# Altium schematic sheet ClockSystem.SchDoc
size 594 x 420 mm
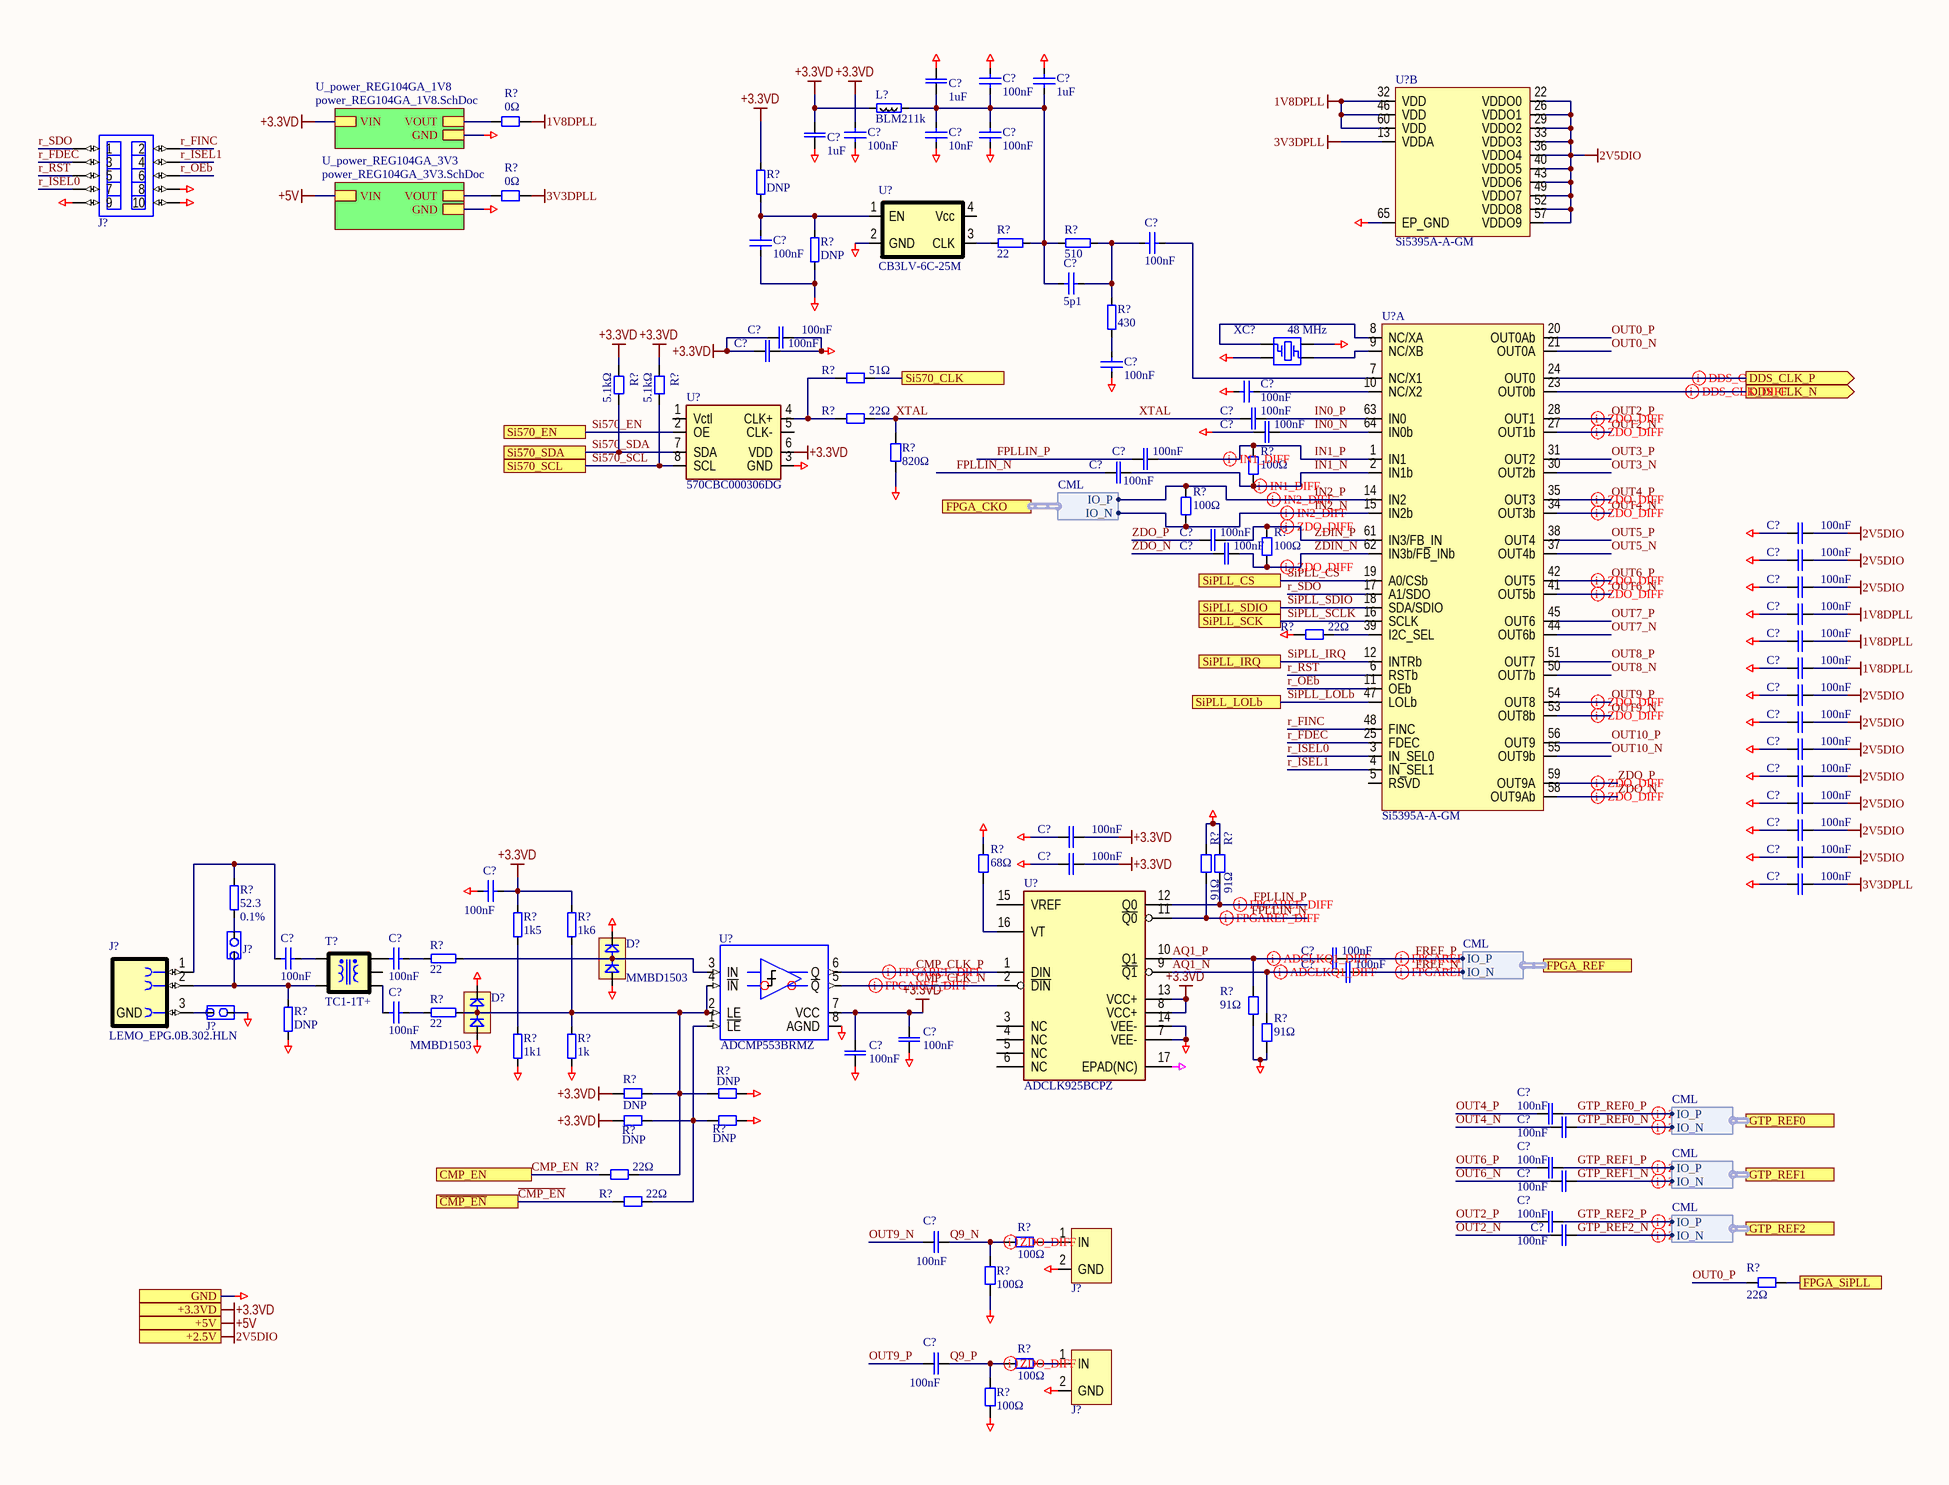
[diagram p0: ClockSystem.SchDoc]

## Parts
(Parts that share a designator on the sheet are numbered #1, #2 ... from top to bottom, then left to right.)
C?#1  100nF  [SMD0805CAP]
C?#2  1uF  [SMD0805CAP]
C?#3  1uF  [0508]
C?#4  1uF  [0508]
C?#5  100nF  [CAPC1608X87N]
C?#6  10nF  [CAPC1608X87N]
C?#7  100nF  [CAPC1608X87N]
C?#8  100nF  [CAPC1608X87N]
C?#9  100nF  [CAPC1608X87N]
C?#10  5p1  [CAPC1608X87N]
C?#11  100nF  [CAPC1608N]
C?#12  100nF  [CAPC1608N]
C?#13  100nF  [CAPC1608X87N]
C?#14  100nF  [CAPC1608X87N]
C?#15  100nF  [CAPC1608N]
C?#16  100nF  [CAPC1608N]
C?#17  100nF  [CAPC1608N]
C?#18  100nF  [CAPC1608N]
C?#19  100nF  [CAPC1608N]
C?#20  100nF  [CAPC1608N]
C?#21  100nF  [CAPC1608N]
C?#22  100nF  [CAPC1608N]
C?#23  100nF  [CAPC1608N]
C?#24  100nF  [CAPC1608N]
C?#25  100nF  [CAPC1608N]
C?#26  100nF  [CAPC1608N]
C?#27  100nF  [CAPC1608N]
C?#28  100nF  [CAPC1608N]
C?#29  100nF  [CAPC1608N]
C?#30  100nF  [CAPC1608N]
C?#31  100nF  [CAPC1608N]
C?#32  100nF  [CAPC1608N]
C?#33  100nF  [CAPC1608N]
C?#34  100nF  [CAPC1608N]
C?#35  100nF  [CAPC1608N]
C?#36  100nF  [CAPC1608N]
C?#37  100nF  [SMD0805CAP]
C?#38  100nF  [SMD0805CAP]
C?#39  100nF  [SMD0805CAP]
C?#40  100nF  [CAPC1608N]
C?#41  100nF  [CAPC1608N]
C?#42  100nF  [SMD0805CAP]
C?#43  100nF  [CAPC1608N]
C?#44  100nF  [CAPC1608N]
C?#45  100nF  [CAPC1608N]
C?#46  100nF  [CAPC1608N]
C?#47  100nF  [CAPC1608N]
C?#48  100nF  [CAPC1608N]
C?#49  100nF  [CAPC1608N]
C?#50  100nF  [CAPC1608N]
C?#51  100nF  [CAPC1608N]
C?#52  100nF  [CAPC1608N]
D?#1  MMBD1503  [SOT95P280X115-3N]
D?#2  MMBD1503  [SOT95P280X115-3N]
J?#1  DNP  [PLD-10]  (value not drawn)
J?#2  PLS-2  [PLS-2]  (value not drawn)
J?#3  LEMO_EPG.0B.302.HLN  [LEMO_EPG.0B.302.HLN]
J?#4  PLS-2  [PLS-2]  (value not drawn)
J?#5  DNP  [LEMO_EPA.00.250.NTN]  (value not drawn)
J?#6  DNP  [LEMO_EPA.00.250.NTN]  (value not drawn)
L?  BLM211k  [RESC2012X50N]
R?#1  0Ω  [RESC2012N]
R?#2  0Ω  [RESC2012N]
R?#3  DNP  [SMD0805RES]
R?#4  22  [SMD0805RES]
R?#5  510  [SMD0805RES]
R?#6  DNP  [SMD0805RES]
R?#7  430  [SMD0805RES]
R?#8  5.1kΩ  [RESC2012N]
R?#9  5.1kΩ  [RESC2012N]
R?#10  51Ω  [RESC2012N]
R?#11  22Ω  [RESC1608N]
R?#12  820Ω  [RESC1608N]
R?#13  100Ω  [RESC1608N]
R?#14  100Ω  [RESC1608N]
R?#15  100Ω  [RESC1608N]
R?#16  22Ω  [RESC1608N]
R?#17  68Ω  [RESC1608N]
R?#18  91Ω  [RESC1608N]
R?#19  91Ω  [RESC1608N]
R?#20  52.3  Tolerance: 0.1%  [SMD0805RES]
R?#21  1k5  [SMD0805RES]
R?#22  1k6  [SMD0805RES]
R?#23  22  [SMD0805RES]
R?#24  22  [SMD0805RES]
R?#25  91Ω  [RESC1608N]
R?#26  DNP  [SMD0805RES]
R?#27  91Ω  [RESC1608N]
R?#28  1k1  [SMD0805RES]
R?#29  1k  [SMD0805RES]
R?#30  DNP  [RESC1608N]
R?#31  DNP  [RESC1608N]
R?#32  DNP  [RESC1608N]
R?#33  DNP  [RESC1608N]
R?#34  22Ω  [RESC1608N]
R?#35  22Ω  [RESC1608N]
R?#36  100Ω  [RESC1608N]
R?#37  22Ω  [RESC1608N]
R?#38  100Ω  [RESC1608N]
R?#39  100Ω  [RESC1608N]
R?#40  100Ω  [RESC1608N]
T?  TC1-1T+  [XFMR_MINI-CIRCUITS_AT224]
U?#1  Si5395A-A-GM  [QFN50P900X900X100-65N-S530]  (part B of 2)
U?#2  CB3LV-6C-25M  [OSCSC508P500X700X160-4N]
U?#3  Si5395A-A-GM  [QFN50P900X900X100-65N-S530]  (part A of 2)
U?#4  570CBC000306DG  [FP-57x-MFG]
U?#5  ADCLK925BCPZ  [QFN50P300X300X100-17N-S150]
U?#6  ADCMP553BRMZ  [SOP65P490X110-8N]
XC?  value 48 MHz  [SMD3225_4PIN_XTAL]  (hidden comment: CX3225SB48000D0WPSC1)

## Sub-sheets
U_power_REG104GA_1V8 = power_REG104GA_1V8.SchDoc: GND, VOUT, VIN
U_power_REG104GA_3V3 = power_REG104GA_3V3.SchDoc: GND, VOUT, VIN

## Ports
+2.5V, +3.3VD, +5V, CMP_EN, DDS_CLK_N (out), DDS_CLK_P (out), FPGA_CKO (harness CML), FPGA_REF (harness CML), FPGA_SiPLL, GND, GTP_REF0 (harness CML), GTP_REF1 (harness CML), GTP_REF2 (harness CML), Si570_CLK, Si570_EN, Si570_SCL, Si570_SDA, SiPLL_CS, SiPLL_IRQ, SiPLL_LOLb, SiPLL_SCK, SiPLL_SDIO, ~{CMP_EN}

## Harnesses
CML: IO_N, IO_P

## Nets
1V8DPLL: C?#24.2 C?#25.2 C?#26.2 R?#1.1 U?#1.32(VDD) U?#1.46(VDD) U?#1.60(VDD)
2V5DIO: C?#19.2 C?#22.2 C?#23.2 C?#27.2 C?#28.2 C?#29.2 C?#30.2 C?#31.2 C?#32.2 C?#34.2 U?#1.22(VDDO0) U?#1.26(VDDO1) U?#1.29(VDDO2) U?#1.33(VDDO3) U?#1.36(VDDO4) U?#1.40(VDDO5) U?#1.43(VDDO6) U?#1.49(VDDO7) U?#1.52(VDDO8) U?#1.57(VDDO9) ; port +2.5V
3V3DPLL: C?#36.2 R?#2.1 U?#1.13(VDDA)
+3.3VD: C?#4.1 C?#5.2 C?#11.1 C?#12.1 C?#33.2 C?#35.2 C?#37.1 C?#43.1 C?#44.1 L?.1 R?#3.2 R?#8.1 R?#9.1 R?#21.2 R?#22.2 R?#30.1 R?#32.1 U?#4.6(VDD) U?#5.8(VCC+) U?#5.13(VCC+) U?#6.7(VCC) ; port +3.3VD, sheet U_power_REG104GA_1V8/VIN
+5V: port +5V, sheet U_power_REG104GA_3V3/VIN
GEPAD: U?#5.17(EPAD(NC))
GND: C?#1.1 C?#2.1 C?#3.2 C?#4.2 C?#5.1 C?#6.1 C?#7.1 C?#9.1 C?#11.2 C?#12.2 C?#13.1 C?#14.2 C?#16.1 C?#19.1 C?#22.1 C?#23.1 C?#24.1 C?#25.1 C?#26.1 C?#27.1 C?#28.1 C?#29.1 C?#30.1 C?#31.1 C?#32.1 C?#33.1 C?#34.1 C?#35.1 C?#36.1 C?#37.2 C?#43.2 C?#44.2 D?#1.1 D?#1.2 D?#2.1 D?#2.2 J?#1.8 J?#1.9 J?#1.10 J?#4.2 J?#5.2(GND) J?#6.2(GND) R?#6.1 R?#12.2 R?#16.1 R?#17.2 R?#18.2 R?#19.2 R?#25.1 R?#26.1 R?#27.1 R?#28.1 R?#29.1 R?#31.2 R?#33.2 R?#38.1 R?#40.1 U?#1.65(EP_GND) U?#2.2(GND) U?#4.3(GND) U?#5.7(VEE-) U?#5.14(VEE-) U?#6.8(AGND) XC?.2(SLD) XC?.4(SLD) ; port GND, sheet U_power_REG104GA_1V8/GND, sheet U_power_REG104GA_3V3/GND
AQ1_N: C?#41.1 R?#27.2 U?#5.9(~{Q1})
AQ1_P: C?#40.1 R?#25.2 U?#5.10(Q1)
~{CMP_EN}: R?#35.1 ; port ~{CMP_EN}
CMP_CLK_N: U?#5.2(~{DIN}) U?#6.5(~{Q})
CMP_CLK_P: U?#5.1(DIN) U?#6.6(Q)
CMP_EN: R?#34.1 ; port CMP_EN
DDS_CLK_N: U?#3.23(OUT0b) ; port DDS_CLK_N
DDS_CLK_P: U?#3.24(OUT0) ; port DDS_CLK_P
FPGA_SiPLL: R?#37.2 ; port FPGA_SiPLL
FPLLIN_N: C?#18.1 R?#18.1 U?#5.11(~{Q0})
FPLLIN_P: C?#17.1 R?#19.1 U?#5.12(Q0)
FREF_N: C?#41.2 ; port FPGA_REF.IO_N
FREF_P: C?#40.2 ; port FPGA_REF.IO_P
GTP_REF0_N: C?#46.2 ; port GTP_REF0.IO_N
GTP_REF0_P: C?#45.2 ; port GTP_REF0.IO_P
GTP_REF1_N: C?#48.2 ; port GTP_REF1.IO_N
GTP_REF1_P: C?#47.2 ; port GTP_REF1.IO_P
GTP_REF2_N: C?#50.2 ; port GTP_REF2.IO_N
GTP_REF2_P: C?#49.2 ; port GTP_REF2.IO_P
IN0_N: C?#16.2 U?#3.64(IN0b)
IN0_P: C?#15.2 U?#3.63(IN0)
IN1_N: C?#18.2 R?#13.1 U?#3.2(IN1b)
IN1_P: C?#17.2 R?#13.2 U?#3.1(IN1)
IN2_N: R?#14.1 U?#3.15(IN2b) ; port FPGA_CKO.IO_N
IN2_P: R?#14.2 U?#3.14(IN2) ; port FPGA_CKO.IO_P
OUT0_N: U?#3.21(OUT0A)
OUT0_P: R?#37.1 U?#3.20(OUT0Ab)
OUT2_N: C?#50.1 U?#3.27(OUT1b)
OUT2_P: C?#49.1 U?#3.28(OUT1)
OUT3_N: U?#3.30(OUT2b)
OUT3_P: U?#3.31(OUT2)
OUT4_N: C?#46.1 U?#3.34(OUT3b)
OUT4_P: C?#45.1 U?#3.35(OUT3)
OUT5_N: U?#3.37(OUT4b)
OUT5_P: U?#3.38(OUT4)
OUT6_N: C?#48.1 U?#3.41(OUT5b)
OUT6_P: C?#47.1 U?#3.42(OUT5)
OUT7_N: U?#3.44(OUT6b)
OUT7_P: U?#3.45(OUT6)
OUT8_N: U?#3.50(OUT7b)
OUT8_P: U?#3.51(OUT7)
OUT9_N: C?#51.1 U?#3.53(OUT8b)
OUT9_P: C?#52.1 U?#3.54(OUT8)
OUT10_N: U?#3.55(OUT9b)
OUT10_P: U?#3.56(OUT9)
Q9_N: C?#51.2 R?#36.1 R?#38.2
Q9_P: C?#52.2 R?#39.1 R?#40.2
r_FDEC: J?#1.3 U?#3.25(FDEC)
r_FINC: J?#1.2 U?#3.48(FINC)
r_ISEL0: J?#1.7 U?#3.3(IN_SEL0)
r_ISEL1: J?#1.4 U?#3.4(IN_SEL1)
r_OEb: J?#1.6 U?#3.11(OEb)
r_RST: J?#1.5 U?#3.6(RSTb)
r_SDO: J?#1.1 U?#3.17(A1/SDO)
Si570_CLK: R?#10.2 ; port Si570_CLK
Si570_EN: U?#4.2(OE) ; port Si570_EN
Si570_SCL: R?#9.2 U?#4.8(SCL) ; port Si570_SCL
Si570_SDA: R?#8.2 U?#4.7(SDA) ; port Si570_SDA
SiPLL_CS: U?#3.19(A0/CSb) ; port SiPLL_CS
SiPLL_IRQ: U?#3.12(INTRb) ; port SiPLL_IRQ
SiPLL_LOLb: U?#3.47(LOLb) ; port SiPLL_LOLb
SiPLL_SCLK: U?#3.16(SCLK) ; port SiPLL_SCK
SiPLL_SDIO: U?#3.18(SDA/SDIO) ; port SiPLL_SDIO
XTAL: C?#15.1 R?#11.2 R?#12.1
ZDIN_N: C?#21.2 R?#15.1 U?#3.62(IN3b/FB_INb)
ZDIN_P: C?#20.2 R?#15.2 U?#3.61(IN3/FB_IN)
ZDO_N: C?#21.1 U?#3.58(OUT9Ab)
ZDO_P: C?#20.1 U?#3.59(OUT9A)
NetC?#1_2: C?#1.2 C?#2.2 C?#3.1 C?#6.2 C?#7.2 C?#10.2 L?.2 R?#4.1 R?#5.2
NetC?#8_1: C?#8.1 U?#3.7(NC/X1)
NetC?#8_2: C?#8.2 C?#10.1 R?#5.1 R?#7.1
NetC?#9_2: C?#9.2 R?#3.1 R?#6.2 U?#2.1(EN)
NetC?#13_2: C?#13.2 R?#7.2
NetC?#14_1: C?#14.1 U?#3.10(NC/X2)
NetC?#38_1: C?#38.1 J?#3.1 R?#20.2
NetC?#38_2: C?#38.2 T?.4
NetC?#39_1: C?#39.1 T?.3
NetC?#39_2: C?#39.2 R?#23.2
NetC?#42_1: C?#42.1 T?.1
NetC?#42_2: C?#42.2 R?#24.2
NetD?#1_3: D?#1.3 R?#23.1 U?#6.3(IN)
NetD?#2_3: D?#2.3 R?#22.1 R?#24.1 R?#29.2 R?#30.2 R?#31.1 R?#34.2 U?#6.2(LE) U?#6.4(~{IN})
NetJ?#2_1: J?#2.1 J?#3.2 R?#26.2 T?.6
NetJ?#2_2: J?#2.2 R?#20.1
NetJ?#3_3: J?#3.3(GND) J?#4.1
NetJ?#5_1: J?#5.1(IN) R?#36.2
NetJ?#6_1: J?#6.1(IN) R?#39.2
NetR?#1_2: R?#1.2 ; sheet U_power_REG104GA_1V8/VOUT
NetR?#2_2: R?#2.2 ; sheet U_power_REG104GA_3V3/VOUT
NetR?#4_2: R?#4.2 U?#2.3(CLK)
NetR?#10_1: R?#10.1 R?#11.1 U?#4.4(CLK+)
NetR?#16_2: R?#16.2 U?#3.39(I2C_SEL)
NetR?#17_1: R?#17.1 U?#5.16(VT)
NetR?#21_1: R?#21.1 R?#28.2
NetR?#32_2: R?#32.2 R?#33.1 R?#35.2 U?#6.1(~{LE})
NetU?#3_8: U?#3.8(NC/XA) XC?.1(XTAL+)
NetU?#3_9: U?#3.9(NC/XB) XC?.3(XTAL-)

Not connected (* = marked no-connect by the designer): T? 2; U?#2 4(Vcc); U?#3 5(RSVD); U?#4 1(Vctl) 5(CLK-); U?#5 3(NC) 4(NC) 5(NC) 6(NC) 15(VREF)

## Layout directives
differential pair; rule Differential Pairs Routing [Pref Gap = 0.175mm    Min Gap  = 0.075mm    Max Gap  = 0.5mmPref Width = 0.15mm    Min Width  = 0.075mm    Max Width  = 0.5mm]: IN1_N, IN1_P, IN2_N, IN2_P, OUT2_N, OUT2_P, OUT4_N, OUT4_P, OUT6_N, OUT6_P, OUT9_N, OUT9_P, Q9_N, Q9_P, ZDIN_N, ZDIN_P, ZDO_N, ZDO_P
differential pair; rule Differential Pairs Routing [Pref Gap = 0.175mm    Min Gap  = 0.075mm    Max Gap  = 0.5mmPref Width = 0.25mm    Min Width  = 0.075mm    Max Width  = 0.5mm]: AQ1_N, AQ1_P, CMP_CLK_N, CMP_CLK_P, DDS_CLK_N, DDS_CLK_P, FPLLIN_N, FPLLIN_P, FREF_N, FREF_P
differential pair; rule Differential Pairs Routing [Pref Gap = 0.4mm    Min Gap  = 0.075mm    Max Gap  = 0.5mmPref Width = 0.3mm    Min Width  = 0.075mm    Max Width  = 0.5mm]: GTP_REF0_N, GTP_REF0_P, GTP_REF1_N, GTP_REF1_P, GTP_REF2_N, GTP_REF2_P

## Notes on the sheet
- Подп. и дата
- Инв. № дубл.
- Взам. инв. №
- Инв. № подл.
- Изм.
- Лист
- № докум.
- Подп.
- Дата
- Копировал
- Формат А2

## Library data of the parts
C?#1 C?#2 = C0805: Чип конденсатор 0805; Voltage: 25V; Vendor: Vishay; DielectricType: X5R; SMD Solders: 2; Solder Option: RM; Tolerance: 20%; Pkg: SMD0805; Device: Cap0805; Price: 2
  C?#1: Value: 100nF
  C?#2: Value: 1uF
C?#3 C?#4 = CAP_LLL219R71A105: 1uF; 10V; 0805R; X7R; Low ESL; Reverse geometry; Vendor: muRata; SolderOption: 2; THD Solders: 0; PartField: LLL219R71A105; Pkg: 0508; Value: 1uF; SMD Solders: 2; ClassName: Soldered_BINP
C?#5-C?#10 C?#13 C?#14 = C0603: Чип конденсатор 0603; Voltage: 50V; Vendor: Vishay; DielectricType: X5R; SMD Solders: 2; Solder Option: RM; Tolerance: 20%; Pkg: SMD0603; Device: Cap603; Price: 2
  C?#5 C?#7-C?#9 C?#13 C?#14: Value: 100nF
  C?#6: Value: 10nF
  C?#10: Value: 5p1
C?#11 C?#12 C?#15-C?#36 C?#40 C?#41 C?#43-C?#52 = CAPC: Generic ceramic SMD capacitor; Pkg: 0603; Maintainer: Evgeniy Kotov; SMD Solders: 2; THD Solders: 0; PartField: 100nF; Last Change Data: 06.03.2017; Release Date: 06.03.2017; Value: 100nF
C?#37-C?#39 C?#42 = C0805: Чип конденсатор 0805; Voltage: 50V; Vendor: Vishay; DielectricType: X5R; SMD Solders: 2; Solder Option: RM; Tolerance: 20%; Pkg: SMD0805; Device: Cap0805; Value: 100nF; Price: 2
D?#1 D?#2 = MMBD1503: High Conductance Low Leakage Diode; SolderOption: 0; Pkg: SOT-3N; SMD Solders: 3; HelpURL: https://www.engineering.uiowa.edu/sites/default/files/ees/files/NI/pdfs/01/30/DS013013.pdf; Value: MMBD1503; PartField: MMBD1503; THD Solders: 0
J?#1 = IDC-10MS: Connector, 5x2, Male, 2.54mm Pitch, Strait contacts, with Body; PartField: IDC-10MC; SMD Solders: 0; THD Solders: 10; Maintainer: Evgeniy Kotov; Pkg: IDC-10; Last Change Data: 28.03.2017; Release Date: 28.03.2017; Value: DNP; ComponentLink1Description: Datasheet
J?#2 J?#4 = PLS-2: Connector, 5x2, Male, 2.54mm Pitch, Right Angle; SMD Solders: 0; THD Solders: 2; Maintainer: Evgeniy Kotov; PartField: PLS-2; Last Change Data: 02.04.2017; Release Date: 02.04.2017; Value: PLS-2; ComponentLink1Description: Datasheet; Pkg: PLS-2
J?#3 = LEMO_EPG.0B.302.HLN: LEMO дифференциальный, угдовой; SMD Solders: 0; Solder Option: RM; THD Solders: 6; Price: 5000; Vendor: LEMO; Pkg: LEMO_EPG.0B.302.HLN; Device: LEMO_EPG.0B.302.HLN; Name to order: LEMO_EPG.0B.302.HLN
J?#5 J?#6 = LEMO_EPA.00.250: PartField: EPA.00.250.NTN; SolderOption: 0; Pkg: LEMO 5pin; THD Solders: 5; Value: DNP; SMD Solders: 0
L? = BLM21: SMD Ferrite bead 0805; Vendor: Vishay; Value: 1k; Pkg: SMD0805; SMD Solders: 2; Solder Option: RM; Price: 10; Device: BLM21
R?#1 R?#2 R?#8-R?#10 = RESC: Resistor, Generic, SMD; Pkg: 0805; Maintainer: Evgeniy Kotov; SMD Solders: 2; THD Solders: 0; Release Date: 06.03.2017; Last Change Data: 09.03.2017
  R?#1 R?#2: PartField: 0Ω; Value: 0Ω
  R?#8 R?#9: PartField: 5.1kΩ; Value: 5.1kΩ
  R?#10: PartField: 51Ω; Value: 51Ω
R?#3 R?#6 R?#21 R?#22 R?#26 R?#28 R?#29 = R0805: Чип резистор 0805; Vendor: Vishay; SMD Solders: 2; Solder Option: i; TC: 100ppm/C; Tolerance: 1%; Pkg: SMD0805; Pwr: 125mW; Device: Res0805; Price: 2
  R?#3 R?#6 R?#26: Value: DNP
  R?#21: Value: 1k5
  R?#22: Value: 1k6
  R?#28: Value: 1k1
  R?#29: Value: 1k
R?#4 R?#5 R?#7 R?#23 R?#24 = R0805: Чип резистор 0805; Vendor: Vishay; SMD Solders: 2; Solder Option: RM; TC: 100ppm/C; Tolerance: 1%; Pkg: SMD0805; Pwr: 125mW; Device: Res0805; Price: 2
  R?#4 R?#23 R?#24: Value: 22
  R?#5: Value: 510
  R?#7: Value: 430
R?#11-R?#19 R?#25 R?#27 R?#34-R?#40 = RESC: Resistor, Generic, SMD; Pkg: 0603; Maintainer: Evgeniy Kotov; SMD Solders: 2; THD Solders: 0; Release Date: 06.03.2017; Last Change Data: 09.03.2017
  R?#11 R?#16 R?#34 R?#35 R?#37: PartField: 22Ω; Value: 22Ω
  R?#12: PartField: 820Ω; Value: 820Ω
  R?#13-R?#15 R?#36 R?#38-R?#40: PartField: 100Ω; Value: 100Ω
  R?#17: PartField: 68Ω; Value: 68Ω
  R?#18 R?#19 R?#25 R?#27: PartField: 91Ω; Value: 91Ω
R?#20 = R0805: Чип резистор 0805; Vendor: Vishay; SMD Solders: 2; Solder Option: RM; TC: 100ppm/C; Pkg: SMD0805; Pwr: 125mW; Device: Res0805; Price: 2; Value: 52.3
R?#30-R?#33 = RESC: Resistor, Generic, SMD; PartField: *Ω; Pkg: 0603; Maintainer: Evgeniy Kotov; SMD Solders: 2; THD Solders: 0; Release Date: 06.03.2017; Last Change Data: 09.03.2017; Value: DNP
T? = TC1-1T+: RF Transformer; 50Ω; 1.5 to 500 MHz; Impedance Ratio=1; Vendor: Texas Instruments; Value: 1:1; Pkg: AT1521; SMD Solders: 5; Solder Option: RM; THD Solders: 0; Price: 1000; Device: TC1-1T+; Name to order: TC1-1T+
U?#1 U?#3 = Si5395A: Manufacturer: SiLabs; SMD Solders: 65; THD Solders: 0; Pkg: QFN-64EP; PartField: Si5395A-A-GM; Value: Si5395A; Vendor: SiLabs
U?#2 = CB3LV: Clock generator; Vendor: CTS Electronic Components; Pkg: 7x5mm; SMD Solders: 4; Solder Option: RM; THD Solders: 0; Current: 60; Value: -6C-25M; Price: 1000; Device: CB3LV; Name to order: CB3LV-6C-25M
U?#4 = Si570: XTAL OSCILLATOR SMD; Manufacturer: Silicon Labs; Manufacturer Part Number: 541AAA001040BAGR; Min Supply Voltage: 2.375V; Max Supply Voltage: 3.465V; Pkg: SMD 6pin; Frequency: 0.2-1500MHz; Nominal Supply Current: 100mA; Maintainer: Evgeniy Kotov; SMD Solders: 6; THD Solders: 0; Value: Si570; Device Class L2: Clock and Timing; ComponentLink2Description: Datasheet; RoHS: TRUE; Device Class L1: Integrated Circuits (ICs); Height: 1.33mm; Octopart: https://octopart.com/541aaa001040bagr-silicon+labs-103392146; ComponentLink2URL: https://www.silabs.com/documents/public/data-sheets/si541-datasheet.pdf; Temperature Range High: +85°C; Category: IC; Ambient Temperature Range High: +85°C; Digikey Description: XTAL OSCILLATOR SMD; Lead Free: Yes; Ambient Temperature Range Low: -40°C; Device Class L3: Timers and Oscillators; Automotive: No; Temperature: -40°C to +85°C; Temperature Range Low: -40°C; Last Change Data: 09.03.2017; PartField: 570CBC000306DG
U?#5 = ADCLK925BCPZ: IC CLK FANOUT BUFFER 1:2 16LFCSP; Manufacturer: Silicon Labs; Number Of Inputs: 2; Standoff Height: 0mm; Number Of Outputs: 4; Pkg: LFCSP-16EP; Max Junction Temp: +125°C; Min Supply Voltage: 1.71V; Number Of Elements: 1; Nominal Supply Current: 65mA; Max Supply Voltage: 3.63V; Logic Function: Non-Inverting; Propagation Delay: 875ps; Maintainer: Evgeniy Kotov; SMD Solders: 17; THD Solders: 0; Manufacturer Part Number: ADCLK925BCPZ; Ambient Temperature Range High: +85°C; Device Class L2: Clock and Timing; Temperature: -40°C to +85°C; Automotive: No; Height: 0.9mm; ComponentLink2URL: https://www.silabs.com/documents/public/data-sheets/si5330x-datasheet.pdf; ComponentLink2Description: Datasheet; Temperature Range High: +85°C; Category: IC; Ambient Temperature Range Low: -40°C; Device Class L1: Integrated Circuits (ICs); Octopart: https://octopart.com/si53307-b-gm-silicon+labs-51374320; Mouser Description: Clock Buffer 1:2 Univ bufr/Lvl Trans 725MHz; Temperature Range Low: -40°C; Device Class L3: Clock Buffers; Ipc Land Pattern Name: QFN50P300X300X85-16; RoHS: TRUE; Digikey Description: IC CLK BUFFER 2:4 725MHZ 16QFN; Lead Free: Yes; PartField: ADCLK925BCPZ; Last Change Data: 09.03.2017; Value: ADCLK925BCPZ
U?#6 = ADCMP553BRMZ: LVDS Comparator; Vendor: Analog Devices Inc; SolderOption: 0; Pkg: MSOP-8; SMD Solders: 8; Manufacturer_Part_Number: ADCMP553BRMZ; Value: ADCMP553BRMZ; PartField: ADCMP553BRMZ; THD Solders: 0
XC? = XTAL_CX3225SB48: Kyocera XTAL 48MHz CX3225SB48000D0WPSC1; Pkg: 4 pin SMD; Maintainer: Evgeniy Kotov; SMD Solders: 4; THD Solders: 0; PartField: CX3225SB48000D0WPSC1; Vendor: Kyocera; Release Date: 06.03.2017; Last Change Data: 09.03.2017